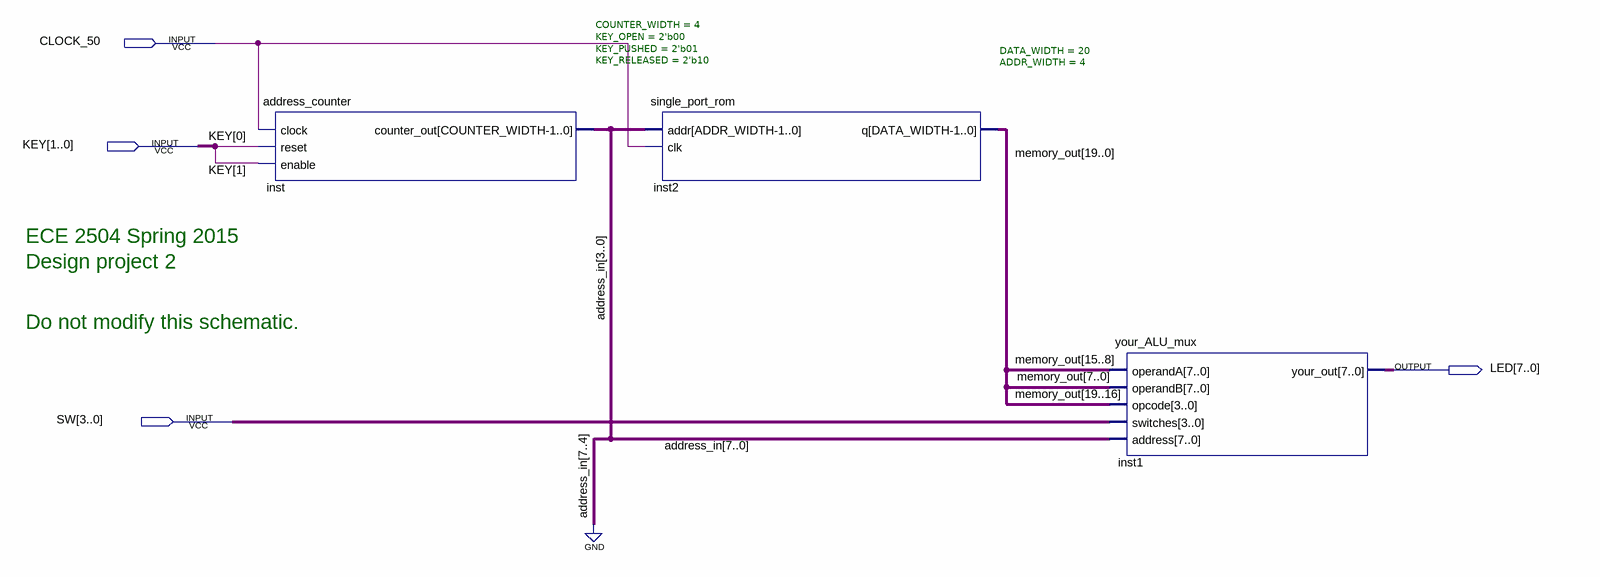
[diagram p0: schematic sheet]
// Quartus schematic DP2_Spring2015.bdf as structural Verilog: 3 symbols, 4 pins
module DP2_Spring2015 (
  input  CLOCK_50,
  input  [1:0] KEY,
  input  [3:0] SW,
  output [7:0] LED
);

  wire [3:0] address_in;
  wire [19:0] memory_out;

  address_counter #(.COUNTER_WIDTH(4), .KEY_OPEN(2'b00), .KEY_PUSHED(2'b01), .KEY_RELEASED(2'b10)) inst (
    .clock(CLOCK_50), .reset(KEY[0]), .enable(KEY[1]), .counter_out(address_in));
  single_port_rom #(.DATA_WIDTH(20), .ADDR_WIDTH(4)) inst2 (.addr(address_in), .clk(CLOCK_50), .q(memory_out));
  your_ALU_mux inst1 (
    .operandA(memory_out[15:8]), .operandB(memory_out[7:0]), .opcode(memory_out[19:16]), .switches(SW),
    .address({4'b0000, address_in}), .your_out(LED));

  // Notes on the sheet:
  //   ECE 2504 Spring 2015
  //   Design project 2
  //   Do not modify this schematic.
endmodule
